# Altium schematic sheet lcd_keyb.SchDoc
size A4
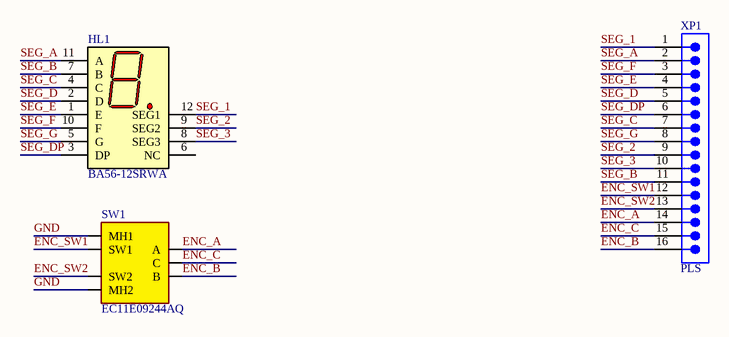
[diagram p0: lcd_keyb.SchDoc]

## Parts
HL1  BA56-12SRWA  [BX56-12]
SW1  EC11E09244AQ  [EC11E09244AQ]
XP1  PLS  [PLS-16R]

## Nets
ENC_A: SW1.A XP1.14
ENC_B: SW1.B XP1.16
ENC_C: SW1.C XP1.15
ENC_SW1: SW1.SW1 XP1.12
ENC_SW2: SW1.SW2 XP1.13
GND: SW1.MH1 SW1.MH2
SEG_1: HL1.12(SEG1) XP1.1
SEG_2: HL1.9(SEG2) XP1.9
SEG_3: HL1.8(SEG3) XP1.10
SEG_A: HL1.11(A) XP1.2
SEG_B: HL1.7(B) XP1.11
SEG_C: HL1.4(C) XP1.7
SEG_D: HL1.2(D) XP1.5
SEG_DP: HL1.3(DP) XP1.6
SEG_E: HL1.1(E) XP1.4
SEG_F: HL1.10(F) XP1.3
SEG_G: HL1.5(G) XP1.8

Not connected (* = marked no-connect by the designer): HL1 6(NC)

## Library data of the parts
HL1 = BA56-12SRWA: Table: Seven Segment Displays; Part Number: BA56-12SRWA; Device: BA56-12SRWA
SW1 = EC11E09244AQ: Table: Button; Part Number: EC11E09244AQ; Device: EC11E09244AQ
XP1 = PLS-16R: Device: PLS-16; Table: AUK; Part Number: PLS-16R; Family: PLS; ComponentLink1URL: http://lib.chipdip.ru/227/DOC000227157.pdf